# EAGLE design TeamD_PDSfinal_m (EAGLE 9.7.0)
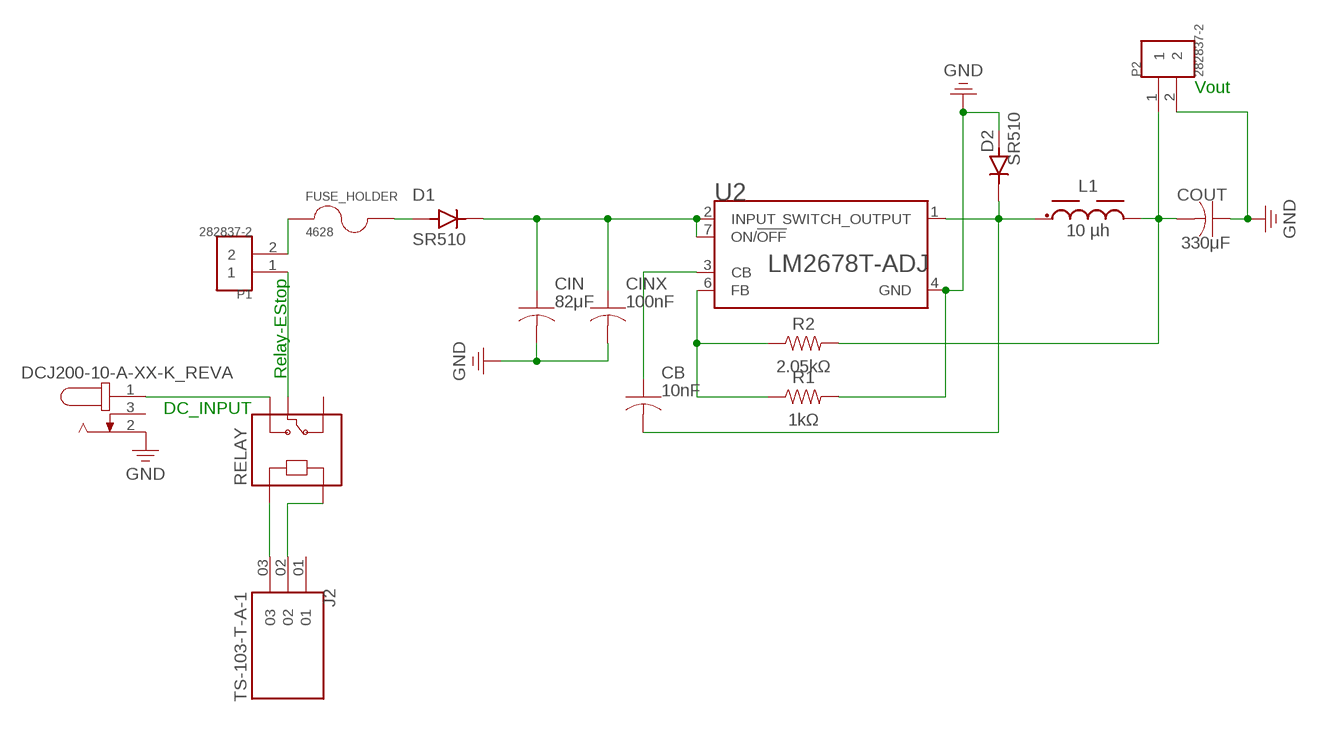
[diagram p0: schematic, sheet 1]

## Parts
CB  10nF  C-US_RADIAL-12.5MM-DIA  [CAPRD550W60D1025H1250B]
CIN  82μF  C-US_RADIAL-12.5MM-DIA  [CAPRD550W60D1025H1250B]
CINX  100nF  C-US_RADIAL-12.5MM-DIA  [CAPRD550W60D1025H1250B]
COUT  330μF  C-US_RADIAL-12.5MM-DIA  [CAPRD550W60D1025H1250B]
D1  SR510  [DIOAD1990W125L900D530]
D2  SR510  [DIOAD1990W125L900D530]
FUSE_HOLDER  4628  [FUSE_4628]
J1  DCJ200-10-A-XX-K_REVA  [GCT_DCJ200-10-A-XX-K_REVA]
J2  TS-103-T-A-1  [SAMTEC_TS-103-T-A-1]
L1  10 µh  WE-TIS_1111  [WE-TIS_1111]
P1  282837-2  [TE_282837-2]
P2  282837-2  [TE_282837-2]
R1  1kΩ  R-US_AXIAL-7.2MM-PITCH  [RESAD724W46L381D178B]
R2  2.05kΩ  R-US_AXIAL-7.2MM-PITCH  [RESAD724W46L381D178B]
RELAY  SRD-05VDC-SL-C  [RELAY_SRD-05VDC-SL-C]
U2  LM2678T-ADJ  [TO127P1041X469X2199-7N]

## Nets
ARDUINO [Signal]: J2.02 RELAY.A2
ARDUINO_2 [Signal]: J2.03 RELAY.A1
D1_LM2678 [Power]: CIN.1 CINX.1 D1.C(K) U2.2(INPUT) U2.7(ON/!OFF)
DC_RELAY [Power]: J1.1 RELAY.NO
ESTOP_FUSE [Power]: FUSE_HOLDER.1 P1.2
FUSE_DIODE [Power]: D1.A FUSE_HOLDER.2
GND [Power]: CIN.2 CINX.2 COUT.1 D2.A J1.2 P2.2 R1.2 U2.4(GND)
IC_CB [Signal]: CB.1 U2.3(CB)
IC_R [Signal]: R1.1 R2.1 U2.6(FB)
L1_OUT [Power]: COUT.2 L1.2 P2.1 R2.2
OUTPUT_L1 [Power]: CB.2 D2.C(K) L1.1 U2.1(SWITCH_OUTPUT)
RELAY_ESTOP [Power]: P1.1 RELAY.COM
Unconnected: J1.3 J2.01 RELAY.NC

## Notes on the sheet
- Vout
- Relay-EStop
- DC_INPUT

## Library data of the parts
CB CIN CINX COUT = Capacitor:C-US: Capacitor - ANSI; CATEGORY: Capacitor; PACKAGE_SIZE: 12.5MM-DIA; PACKAGE_TYPE: THT; SUBCATEGORY: Aluminum Non-Polar Capacitors; TYPE: Radial Can
D1 D2 = SR510:SR510: Check availability <https://pricing.snapeda.com/parts/SR5100/Multicomp/view-part?ref=eda>; AVAILABILITY: Not in stock; CHECK_PRICES: https://www.snapeda.com/parts/SR5100/Multicomp/view-part/?ref=eda; DESCRIPTION: 100mA 250V AC DC Fuse Board Mount (Cartridge Style Excluded) Through Hole Radial, Can, Vertical; MF: Multicomp; MP: SR5100; PACKAGE: Radial Multicomp; PRICE: None; SNAPEDA_LINK: https://www.snapeda.com/parts/SR5100/Multicomp/view-part/?ref=snap
FUSE_HOLDER = 4628:4628; MANUFACTURER: Keystone; MAXIMUM_PACKAGE_HEIGHT: 11.99mm; SNAPEDA_PN: 4628; STANDARD: Manufacturer Recommendation
J1 = DCJ200-10-A-XX-K_REVA:DCJ200-10-A-XX-K_REVA: Check availability <https://pricing.snapeda.com/parts/DCJ200-10-A-K1-K/Global%20Connector%20Technology/view-part?ref=eda>; AVAILABILITY: In Stock; CHECK_PRICES: https://www.snapeda.com/parts/DCJ200-10-A-K1-K/Global+Connector+Technology/view-part/?ref=eda; DESCRIPTION: Power Barrel Connector Jack 2.05mm ID (0.081), 5.50mm OD (0.217) Through Hole, Right Angle; MF: Global Connector Technology; MP: DCJ200-10-A-K1-K; PACKAGE: None; PRICE: None; SNAPEDA_LINK: https://www.snapeda.com/parts/DCJ200-10-A-K1-K/Global+Connector+Technology/view-part/?ref=snap
J2 = TS-103-T-A-1:TS-103-T-A-1: Check availability <https://pricing.snapeda.com/parts/TS-103-T-A-1/Samtec/view-part?ref=eda>; AVAILABILITY: In Stock; CHECK_PRICES: https://www.snapeda.com/parts/TS-103-T-A-1/Samtec/view-part/?ref=eda; DESCRIPTION: 3 Position Header Connector Male Pin Tin; MF: Samtec; MP: TS-103-T-A-1; PACKAGE: None; PRICE: None; SNAPEDA_LINK: https://www.snapeda.com/parts/TS-103-T-A-1/Samtec/view-part/?ref=snap
L1 = WE-TIS_1111:WE-TIS_1111: Check availability <https://pricing.snapeda.com/parts/7447471100/W%C3%BCrth%20Elektronik/view-part?ref=eda>; AVAILABILITY: In Stock; CHECK_PRICES: https://www.snapeda.com/parts/7447471100/W%25C3%25BCrth+Elektronik+Midcom/view-part/?ref=eda; DESCRIPTION: Inductors, Fixed, WE-TIS Lead Rad 1111 10uH 5.1A .0175Ohm | Wurth Electronics 7447471100; MF: Würth Elektronik; MP: 7447471100; PACKAGE: Radial Würth Elektronik; PRICE: None; SNAPEDA_LINK: https://www.snapeda.com/parts/7447471100/W%25C3%25BCrth+Elektronik+Midcom/view-part/?ref=snap
P1 P2 = 282837-2:282837-2: Check availability <https://pricing.snapeda.com/parts/282837-2/TE%20Connectivity/view-part?ref=eda>; AVAILABILITY: In Stock; CHECK_PRICES: https://www.snapeda.com/parts/282837-2/TE+Connectivity+AMP+Connectors/view-part/?ref=eda; COMMENT: 282837-2; DESCRIPTION: Terminal Block Connector Wire Receptacle 2 5.08 mm 30-16 AWG Green 13.5 A 250 V | TE Connectivity 282837-2; MF: TE Connectivity; MP: 282837-2; PACKAGE: None; PRICE: None; SNAPEDA_LINK: https://www.snapeda.com/parts/282837-2/TE+Connectivity+AMP+Connectors/view-part/?ref=snap
R1 R2 = Resistor:R-US: Resistor Fixed - ANSI; CATEGORY: Resistors; DESCRIPTION: Axial Resistor 7.24 mm pitch 3.81 mm body length 1.78 mm body diameter; PACKAGE_SIZE: AXIAL; PACKAGE_TYPE: THT
RELAY = SRD-05VDC-SL-C:SRD-05VDC-SL-C: Check availability <https://pricing.snapeda.com/parts/SRD-05VDC-SL-C/Songle%20Relay/view-part?ref=eda>; AVAILABILITY: In Stock; CHECK_PRICES: https://www.snapeda.com/parts/SRD-05VDC-SL-C/Songle+Relay/view-part/?ref=eda; DESCRIPTION: 5V Trigger Relay Module For Arduino And Raspberry Pi 5V Trigger Relay Module For Arduino And Raspberry Pi; MF: Songle Relay; MP: SRD-05VDC-SL-C; PACKAGE: NON STANDARD-5 Songle Relay; PRICE: None; SNAPEDA_LINK: https://www.snapeda.com/parts/SRD-05VDC-SL-C/Songle+Relay/view-part/?ref=snap
U2 = LM2678T-ADJ:LM2678T-ADJ: Check availability <https://pricing.snapeda.com/parts/LM2678T-ADJ/Texas%20Instruments/view-part?ref=eda>; AVAILABILITY: In Stock; CHECK_PRICES: https://www.snapeda.com/parts/LM2678T-ADJ/Texas+Instruments/view-part/?ref=eda; DESCRIPTION: 8V to 40V, 5A SIMPLE SWITCHER buck converter with high efficiency 7-TO-220 -40 to 125; MF: Texas Instruments; MP: LM2678T-ADJ; PACKAGE: TO-220-7 Texas Instruments; PRICE: None; SNAPEDA_LINK: https://www.snapeda.com/parts/LM2678T-ADJ/Texas+Instruments/view-part/?ref=snap

## Net classes
1 Power: width 1.829 mm
2 Signal: width 0.254 mm

## Board
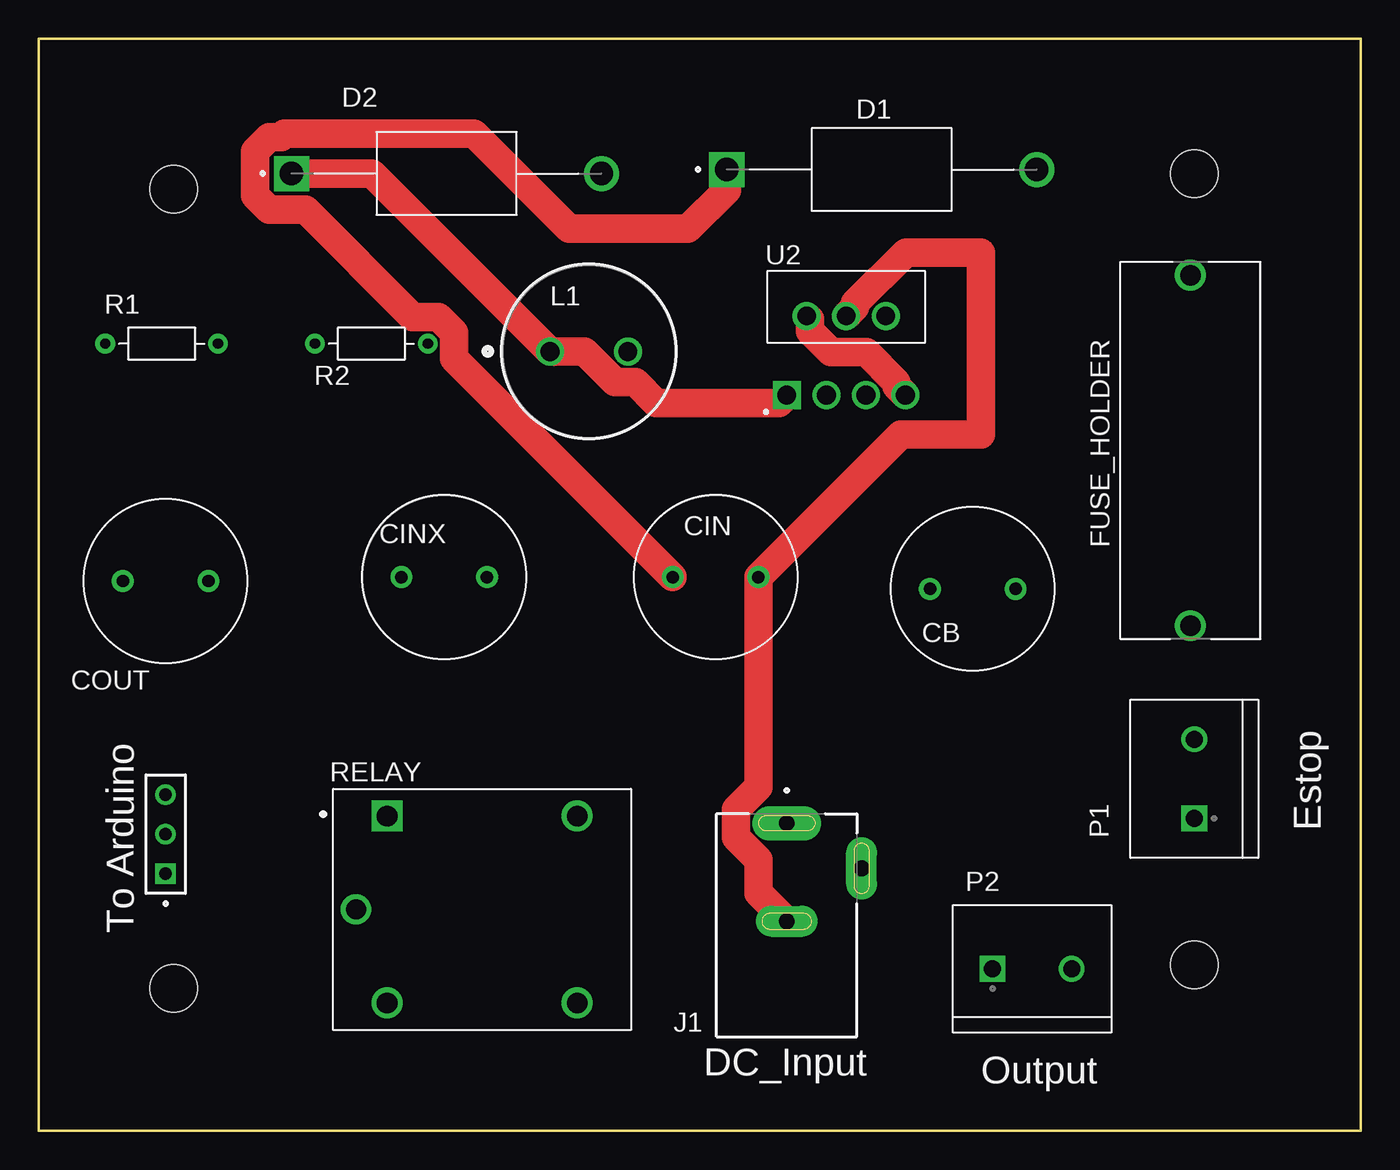
[diagram p1: board, top side]
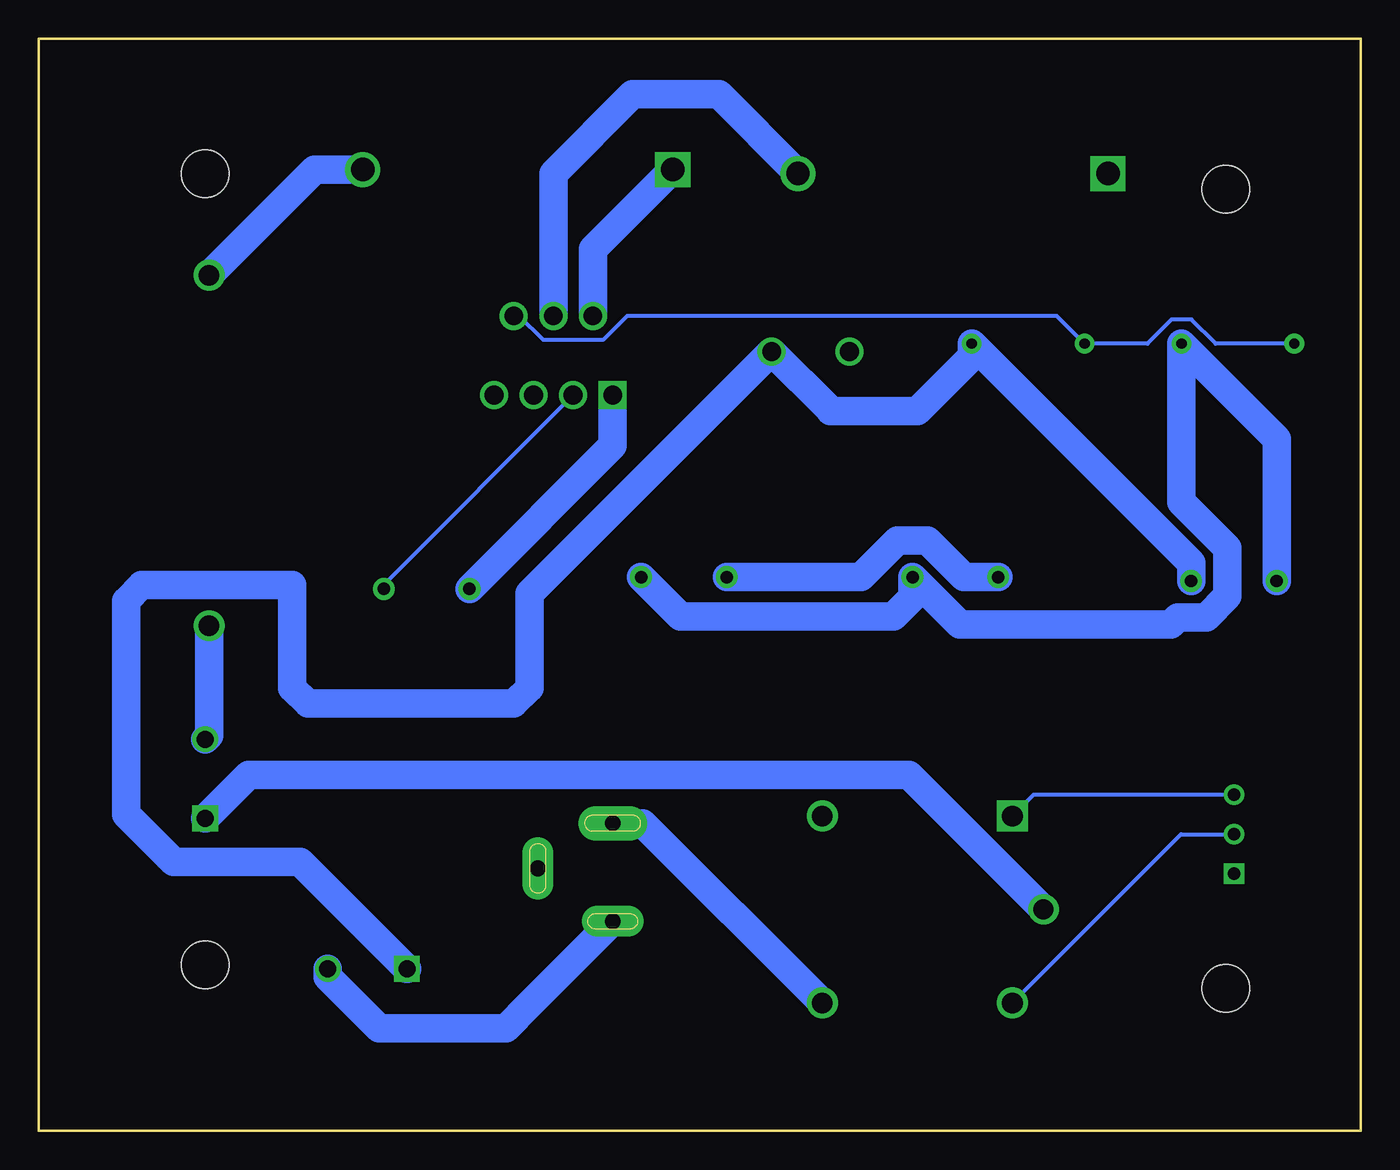
[diagram p2: board, bottom side, seen from below]

Size 84.84 x 70.1 mm. Coordinates in mm from the lower left corner, seen from the top.
Outline: 0,70.1 84.84,70.1 84.84,0 0,0 0,70.1
Copper layers (1*16): Top 0.035mm / dielectric 1.5mm / Bottom 0.035mm
Design rules "Fusion Electronics Design Rules": minimum track width 6mil, minimum drill 0.35mm, track to track 20mil, track to pad 6mil, pad to pad 6mil, via to via 6mil, smd to smd 6mil, copper to edge 40mil, drill to drill 6mil, minimum pad ring 10mil, minimum via ring 8mil, stop-mask expansion 4mil, vias tented up to drill 0mil, thermal gap 10mil
Holes 3.05 mm at 8.64,9.14 8.64,60.45 74.17,61.47 74.17,10.67

### Footprints (pad centres in the part's own frame; a part is rotated, then mirrored left to right if it is on the bottom)
CAPRD550W60D1025H1250B = drill 0.8 pad 1.4: 1 -2.75,0; 2 2.75,0
DIOAD1990W125L900D530 = drill 1.5: A 9.95,0 | drill 1.5 square: C -9.95,0
FUSE_4628 = drill 1.32: 1 -11.25,0; 2 11.25,0
GCT_DCJ200-10-A-XX-K_REVA = drill 1 pad 2.2 long: 1 0,6.55 | drill 1 pad 2 long: 2 0,0.25; 3 4.8,3.65
SAMTEC_TS-103-T-A-1 = drill 0.813 pad 1.163 square: 01 -2.54,0 | drill 0.813 pad 1.163: 02 0,0; 03 2.54,0
WE-TIS_1111 = drill 1.2: 1 -2.5,0; 2 2.5,0
TE_282837-2 = drill 1.1 square: 1 -2.54,0 | drill 1.1: 2 2.54,0
RESAD724W46L381D178B = drill 0.66 pad 1.26: 1 -3.62,0; 2 3.62,0
RELAY_SRD-05VDC-SL-C = drill 1.32 square: A1 -6.1,6 | drill 1.32: A2 -6.1,-6; NC 6.1,6; NO 6.1,-6 | drill 1.29: COM -8.1,0
TO127P1041X469X2199-7N = drill 1.2 square: 1 -3.81,-5.08 | drill 1.2: 2 -2.54,0; 3 -1.27,-5.08; 4 0,0; 5 1.27,-5.08; 6 2.54,0; 7 3.81,-5.08

### Placement (x,y rotation side)
CB  59.94,34.8 180 top
CIN  43.43,35.56 0 top
CINX  26.01,35.56 0 top
COUT  8.13,35.31 0 top
D1  54.1,61.72 0 top
D2  26.16,61.47 0 top
FUSE_HOLDER  73.91,43.69 90 top
J1  48.01,13.21 0 top
J2  8.13,19.05 90 top
L1  35.31,50.04 0 top
P1  74.17,22.61 90 top
P2  63.75,10.41 0 top
R1  7.87,50.55 0 top
R2  21.34,50.55 0 top
RELAY  28.45,14.22 0 top
U2  51.82,52.32 0 top

### Tracks (layer width: path | path; a pad name or v marks a point on that pad's centre or on a via)
ARDUINO
  Bottom 0.254: RELAY.A2 11.52,19.05 J2.02
ARDUINO_2
  Bottom 0.254: RELAY.A1 20.98,21.59 J2.03
D1_LM2678
  Top 1.829: U2.2 49.48,52.12 49.48,51.36 50.85,49.99 53.12,49.99 55.05,48.06 55.05,47.82 U2.7 | CIN.1 26.65,49.59 26.65,51.25 25.66,52.24 24,52.24 17.11,59.13 14.79,59.13 13.88,60.05 13.88,62.89 14.79,63.81 15.55,63.81 15.75,64.01 27.94,64.01 34.04,57.91 41.66,57.91 44.15,60.41 D1.C
  Bottom 1.829: D1.C 49.28,56.6 U2.2 | CINX.1 25.45,35.56 27.79,37.9 29.73,37.9 32.06,35.56 CIN.1
DC_RELAY
  Bottom 1.829: J1.1 46.08,19.76 RELAY.NO
ESTOP_FUSE
  Bottom 1.829: FUSE_HOLDER.1 73.91,25.4 P1.2
FUSE_DIODE
  Bottom 1.829: D1.A 67.13,61.72 FUSE_HOLDER.2
GND
  Top 1.829: U2.4 52.39,52.9 52.39,53.14 55.64,56.39 60.45,56.39 60.45,44.7 55.33,44.7 CIN.2 46.18,22.1 44.74,20.66 44.74,18.86 46.18,17.42 46.18,15.28 J1.2
  Bottom 1.829: J1.2 53.34,8.13 54.86,6.6 62.99,6.6 66.29,9.91 P2.2 | D2.A 41.19,66.55 46.74,66.55 51.82,61.47 U2.4 | COUT.1 5.38,44.43 R1.2 11.49,40.39 8.54,37.44 8.54,34.34 9.91,32.97 11.73,32.97 12.19,32.51 25.71,32.51 CINX.2 28.76,34.23 29.97,33.02 43.64,33.02 CIN.2
IC_CB
  Bottom 0.254: U2.3 62.69,35.1 CB.1
IC_R
  Bottom 0.254: U2.6 54.01,52.32 52.46,50.78 48.63,50.78 47.09,52.32 19.49,52.32 R2.1 13.68,50.55 12.14,52.1 10.85,52.1 9.3,50.55 R1.1
L1_OUT
  Bottom 1.829: COUT.2 10.88,36.47 R2.2 24.96,49.72 28.45,46.23 34.04,46.23 34.04,46.27 L1.2 53.34,34.5 53.34,28.45 54.36,27.43 67.56,27.43 68.58,28.45 68.58,35.05 78.23,35.05 79.25,34.04 79.25,20.32 76.2,17.27 68.07,17.27 P2.1
OUTPUT_L1
  Top 1.829: D2.C 21.38,61.47 L1.1 35.02,50.04 36.99,48.07 38.29,48.07 39.62,46.74 47.5,46.74 U2.1
  Bottom 1.829: CB.2 48.01,43.99 U2.1
RELAY_ESTOP
  Bottom 1.829: RELAY.COM 28.98,22.86 66.55,22.86 71.37,22.86 P1.1

### Text on the board
tNames: Estop | To Arduino | DC_Input | Output